# Altium schematic sheet mạch hoàn chỉnh.SchDoc
size 381 x 241 mm; SheetNumber: 1; SheetTotal: 1
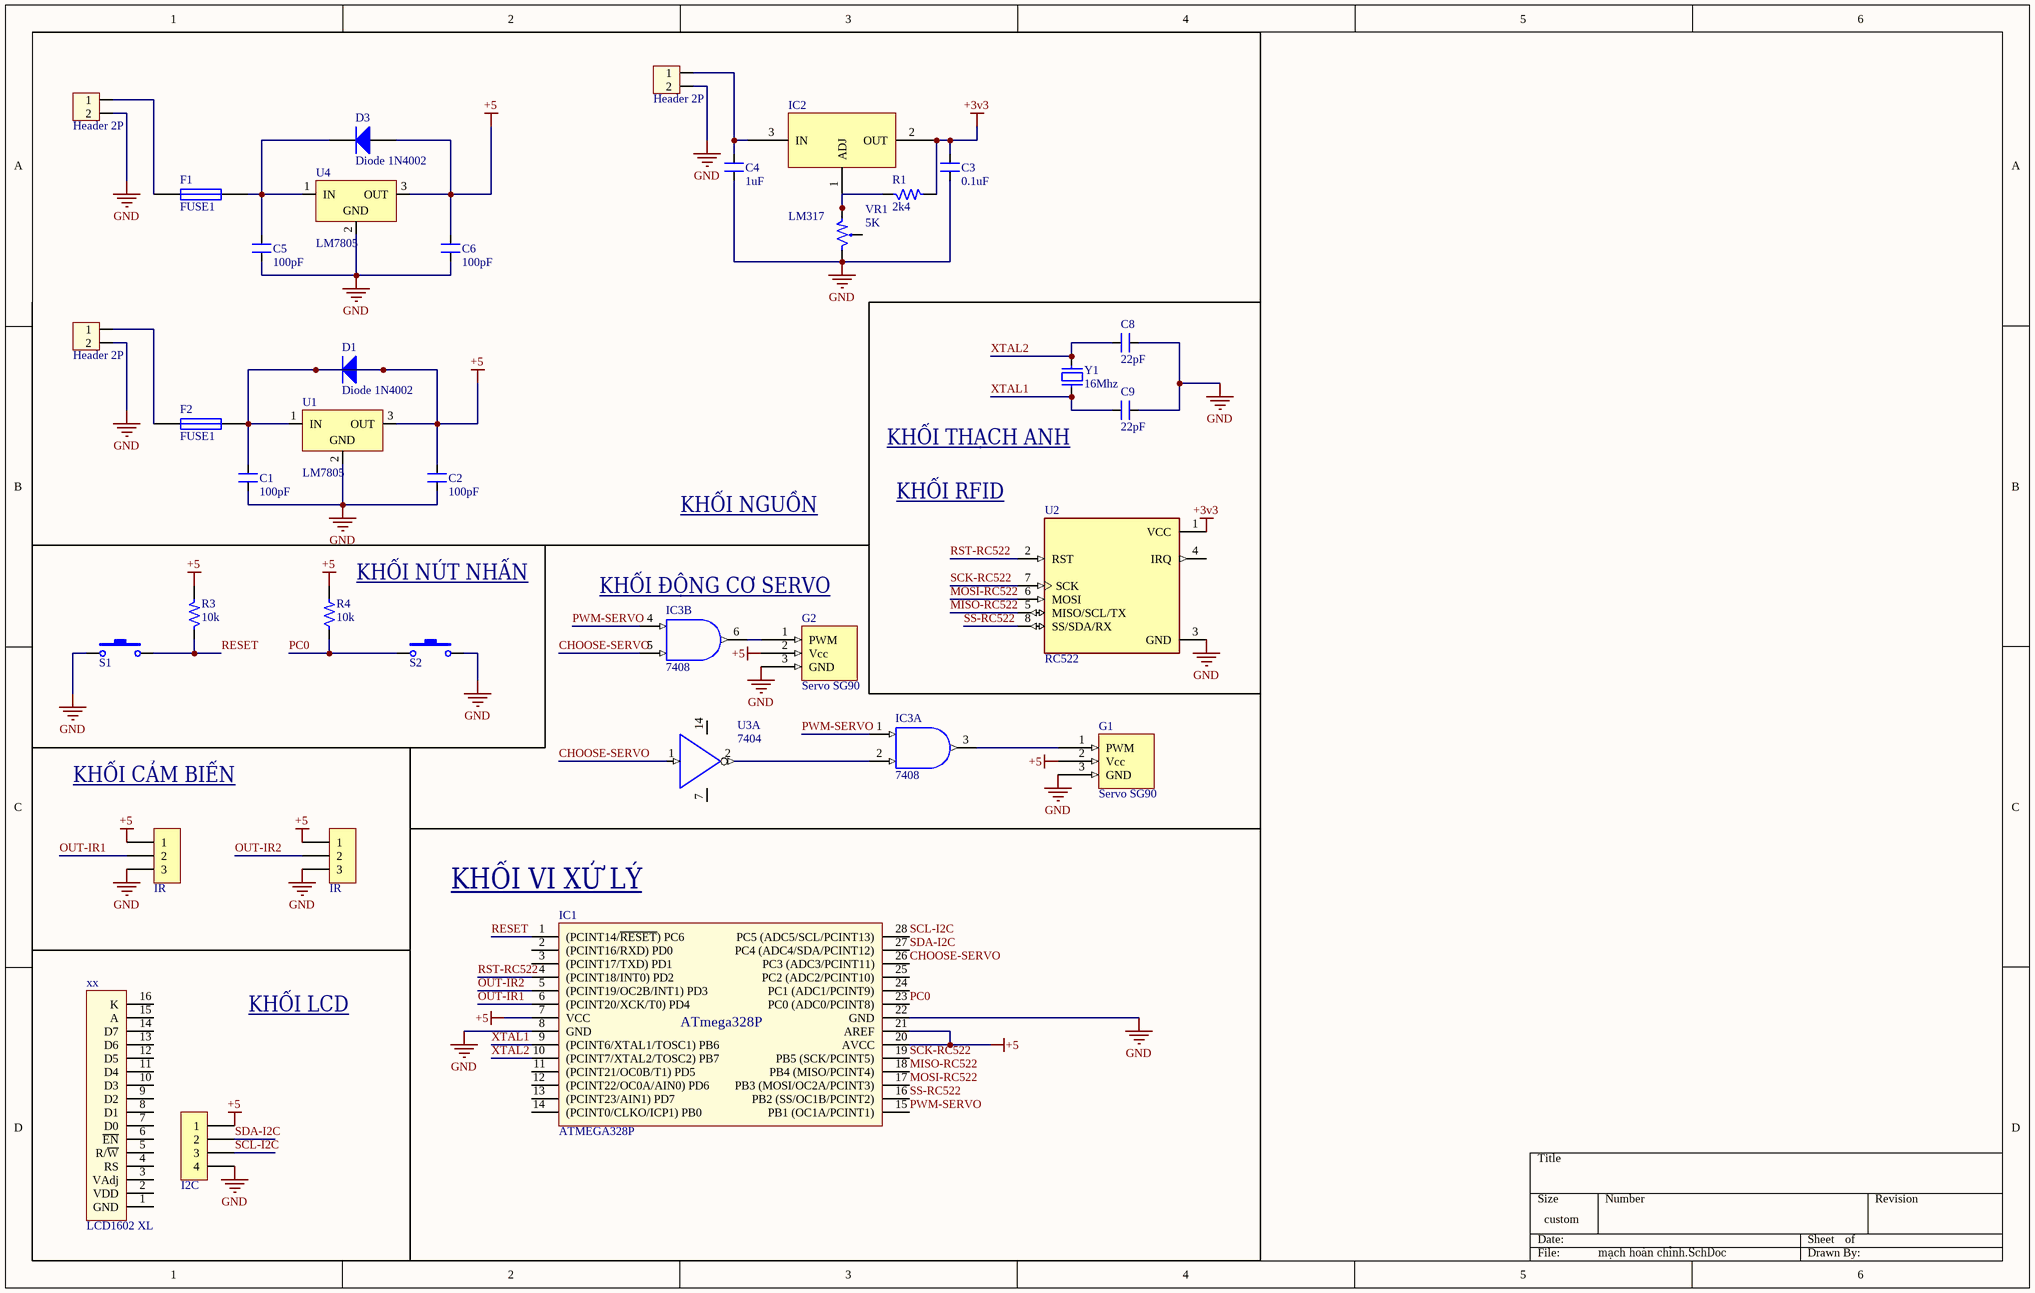
[diagram p0: mạch hoàn chỉnh.SchDoc]

## Parts
C1  100pF  [CAP_100UF_50V]
C2  100pF  [CAP_100UF_50V]
C3  0.1uF  [Tu gom 104]
C4  1uF  [Tu gom 104]
C5  100pF  [CAP_100UF_50V]
C6  100pF  [CAP_100UF_50V]
C8  22pF  [CAP_100UF_50V]
C9  22pF  [CAP_100UF_50V]
D1  Diode 1N4002  [1N4007]
D3  Diode 1N4002  [1N4007]
F1  FUSE1
F2  FUSE1
G1  Servo SG90  [Header 3P DC 2.54]
G2  Servo SG90  [Header 3P DC 2.54]
H1  Header 2P  [XH2.54M-2]
H2  I2C  [XH2.54M-4]
H3  IR  [VH3.96M-3]
H4  IR  [VH3.96M-3]
H5  Header 2P  [XH2.54M-2]
H6  Header 2P  [XH2.54M-2]
IC1  ATMEGA328P  [SOCKET_28]
IC2  LM317  [TO220H1]
IC3  7408  [DIP14]  (parts A,B of 4)
R1  2k4  [CFR25S]
R3  10k  [CFR25S]
R4  10k  [CFR25S]
S1  EVQ11A04M  [BUTTON 2 PIN]  (value not drawn)
S2  EVQ11A04M  [BUTTON 2 PIN]  (value not drawn)
U1  LM7805  [LM7805]
U2  RC522  [MODULE_CEG006900]
U3  7404  [DO14]  (part A of 6)
U4  LM7805  [LM7805]
VR1  5K  [VR1]
xx  LCD1602 XL  [LCD1602 with Jump]
Y1  16Mhz  [Thach Anh 2 chan cam]

## Nets
+3v3: C3.2 IC2.2(OUT) R1.2 U2.1(VCC)
+5: C1.2 C2.2 C6.2 D1.1(A) D1.2(K) D3.1(A) F2.2 G1.2(Vcc) G2.2(Vcc) H2.1 H3.1 H4.1 IC1.7(VCC) IC1.20(AVCC) IC1.21(AREF) R3.2 R4.2 U1.1(IN) U1.3(OUT) U4.3(OUT)
GND: C1.1 C2.1 C3.1 C4.1 C5.1 C6.1 C8.1 C9.1 G1.3(GND) G2.3(GND) H1.2 H2.4 H3.3 H4.3 H5.2 H6.2 IC1.8(GND) IC1.22(GND) IC3.7(GND) S1.1(A) S2.1(A) U1.2(GND) U2.3(GND) U4.2(GND) VR1.3
VCC: IC3.14(VCC)
CHOOSE-SERVO: IC1.26(PC3_(ADC3/PCINT11)) IC3.5(B) U3.1(A)
MISO-RC522: IC1.18(PB4_(MISO/PCINT4)) U2.5(MISO/SCL/TX)
MOSI-RC522: IC1.17(PB3_(MOSI/OC2A/PCINT3)) U2.6(MOSI)
OUT-IR1: H3.2 IC1.6((PCINT20/XCK/T0)_PD4)
OUT-IR2: H4.2 IC1.5((PCINT19/OC2B/INT1)_PD3)
PC0: IC1.23(PC0_(ADC0/PCINT8)) R4.1 S2.2(B)
PWM-SERVO: IC1.15(PB1_(OC1A/PCINT1)) IC3.1(A) IC3.4(A)
RESET: IC1.1((PCINT14/~{RESET})_PC6) R3.1 S1.2(B)
RST-RC522: IC1.4((PCINT18/INT0)_PD2) U2.2(RST)
SCK-RC522: IC1.19(PB5_(SCK/PCINT5)) U2.7(SCK)
SCL-I2C: H2.3 IC1.28(PC5_(ADC5/SCL/PCINT13))
SDA-I2C: H2.2 IC1.27(PC4_(ADC4/SDA/PCINT12))
SS-RC522: IC1.16(PB2_(SS/OC1B/PCINT2)) U2.8(SS/SDA/RX)
XTAL1: C9.2 IC1.9((PCINT6/XTAL1/TOSC1)_PB6) Y1.1
XTAL2: C8.2 IC1.10((PCINT7/XTAL2/TOSC2)_PB7) Y1.2
NetC4_2: C4.2 H5.1 IC2.3(IN)
NetC5_2: C5.2 D3.2(K) F1.2 U4.1(IN)
NetF1_1: F1.1 H6.1
NetF2_1: F2.1 H1.1
NetG1_1: G1.1(PWM) IC3.3(O)
NetG2_1: G2.1(PWM) IC3.6(O)
NetIC2_1: IC2.1(ADJ) R1.1 VR1.1
NetIC3_2: IC3.2(B) U3.2(Y)

Not connected (* = marked no-connect by the designer): IC1 2((PCINT16/RXD)_PD0) 3((PCINT17/TXD)_PD1) 11((PCINT21/OC0B/T1)_PD5) 12((PCINT22/OC0A/AIN0)_PD6) 13((PCINT23/AIN1)_PD7) 14((PCINT0/CLKO/ICP1)_PB0) 24(PC1_(ADC1/PCINT9)) 25(PC2_(ADC2/PCINT10)); U2 4(IRQ); U3 7(GND) 14(VCC); VR1 2; xx 1(GND) 2(VDD) 3(VAdj) 4(RS) 5(R/~{W}) 6(~{EN}) 7(D0) 8(D1) 9(D2) 10(D3) 11(D4) 12(D5) 13(D6) 14(D7) 15(A) 16(K)

## Notes on the sheet
- KHỐI RFID
- KHỐI THẠCH ANH
- KHỐI NGUỒN
- (near R4) KHỐI NÚT NHẤN
- KHỐI ĐỘNG CƠ SERVO
- KHỐI CẢM BIẾN
- (near IC1) KHỐI VI XỬ LÝ
- KHỐI LCD

## Library data of the parts
C1 C2 C5 C6 = CN1: Cap np  1pF - 472pF; Value: 100pF
C3 = CN2: Cap np 104 => 105pF; Value: 0.1uF
C4 C8 C9 = CN1: Cap np  1pF - 472pF; Value: 100pF
D1 D3 = Diode 1N4002: 1 Amp General Purpose Rectifier; Published: 8-Jun-2000; LatestRevisionDate: 17-Jul-2002; LatestRevisionNote: Re-released for DXP Platform.; DatasheetVersion: 1998; PackageVersion: Aug-1999; PackageReference: DO-41; Publisher: Altium Limited; PackageDescription: Diode, Axial; Body 5.2 x 2.7 mm (LxDia. max), Lead Dia. 0.86 mm (max); Code_JEDEC: DO-204-AL; ComponentLink1Description: Manufacturer Link; ComponentLink1URL: http://www.fairchildsemi.com/; ComponentLink2Description: Datasheet; ComponentLink2URL: http://www.fairchildsemi.com/ds/1N%2F1N4001.pdf
F1 F2 = FUSE1: Fuse
G1 G2 = Servo SG90: 180o; Manufacturer: Servo SG90
H1 H5 H6 = Header 2P 2.54 Duc Thang: Cắm; Ten_Linh_Kien: Header 2P XH2.54-2P Đực Thẳng; Don_Vi: Con; Ma_Hang: MH001283; Chung_Loai: Cắm
H2 = Header 4P 2.54 Duc Thang: Cắm; Ten_Linh_Kien: Header 4P XH2.54-4P Đực Thẳng; Don_Vi: Con; Ma_Hang: MH001285; Chung_Loai: Cắm
H3 H4 = Header 3P VH3.96 Duc Thang: Cắm; Ten_Linh_Kien: Header 3P XH2.54-3P Đực Thẳng; Don_Vi: Con; Ma_Hang: MH001292; Chung_Loai: Cắm
IC1 = ATmega328P: Flash 32K, Bytes EEPROM 1K Bytes, RAM 2K Bytes
IC2 = LM317 TO220: Cắm; Ten_Linh_Kien: LM317T TO220 REG LDO ADJ 1.5A; Ma_Hang: MH003115; Don_Vi: Con; Kieu_Chan: *; Ghi_Chu: *; Chung_Loai: Cắm
IC3 = 7408: Quad 2-Input AND Gate; Value: 7408
R1 R3 R4 = R: Resistor 1/4W; Value: R1/4W - 1K
S1 S2 = EVQ11A04M: Tact Switch 2 Pins White 6mm; Value: Button; ComponentLink1Description: Datasheet; ComponentLink1URL: D:\Dropbox\Datasheets\Electromechanical\Switchs\EVQ11.pdf; Unit Price: 0.0060
U1 U4 = LM7805: Linear Voltage Regulator 5V 1A 24V Max TO-220; ComponentLink1Description: Datasheet; ComponentLink1URL: D:\Dropbox\Datasheets\Power Management ICs\Linear Regulators\LM78XX.pdf; Unit Price: 0.3000
U2 = CEG006900: RFID RC522 Reader IC Card Module Tags SPI Interface Read and Write; MF: YKS; Value: *; SnapEDA_Link: https://www.snapeda.com/parts/CEG006900/YKS/view-part/?ref=snap; MP: CEG006900; Check_prices: https://www.snapeda.com/parts/CEG006900/YKS/view-part/?ref=eda; Availability: Not in stock; Price: None; Package: None
U3 = 7404: Text Field1: 30; Text Field2: 40
VR1 = VR2: Var Resistor; Value: VR 10K
xx = LCD1602 XL: LCD 1602 Xanh Lá; Ten: Màn hình LCD 1602 Xanh Lá; Ma_Hang: 67HZ; NCC: NSHOP; CHIP: HD44780
Y1 = Thach Anh 2 chan Cam: Crystal For all Crystal 2pin.; Value: 4Mhz